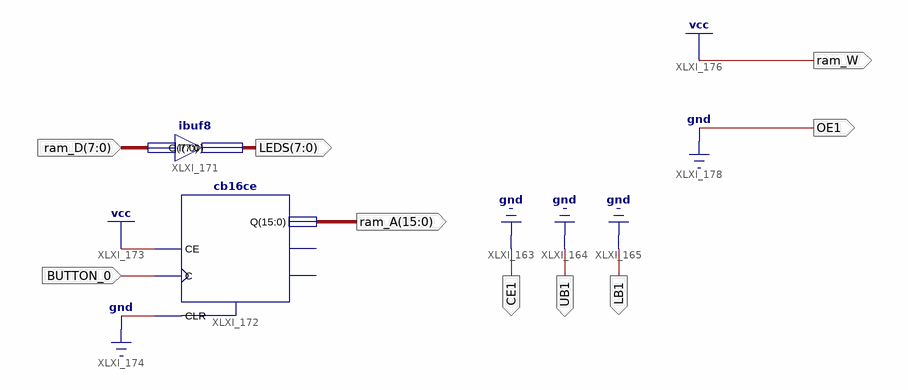
[diagram p0: schematic sheet 1]
// Xilinx ISE schematic amstradROM_check.sch (spartan3) as structural Verilog: 2 symbols, 9 ports
module amstradROM_check (
  input  BUTTON_0,
  input  [7:0] ram_D,
  output ram_W,
  output LB1,
  output CE1,
  output UB1,
  output [7:0] LEDS,
  output [15:0] ram_A,
  output OE1
);

  cb16ce XLXI_172 (.C(BUTTON_0), .CE(1'b1), .CLR(1'b0), .Q(ram_A));  // open: CEO, TC
  ibuf8 XLXI_171 (.I(ram_D), .O(LEDS));

  assign CE1 = 1'b0;
  assign LB1 = 1'b0;
  assign OE1 = 1'b0;
  assign ram_W = 1'b1;
  assign UB1 = 1'b0;
endmodule
